# Altium schematic sheet LPEDT_revA1_bikeit_POWER.SchDoc: Bike It Power Management (part 3 of 3)
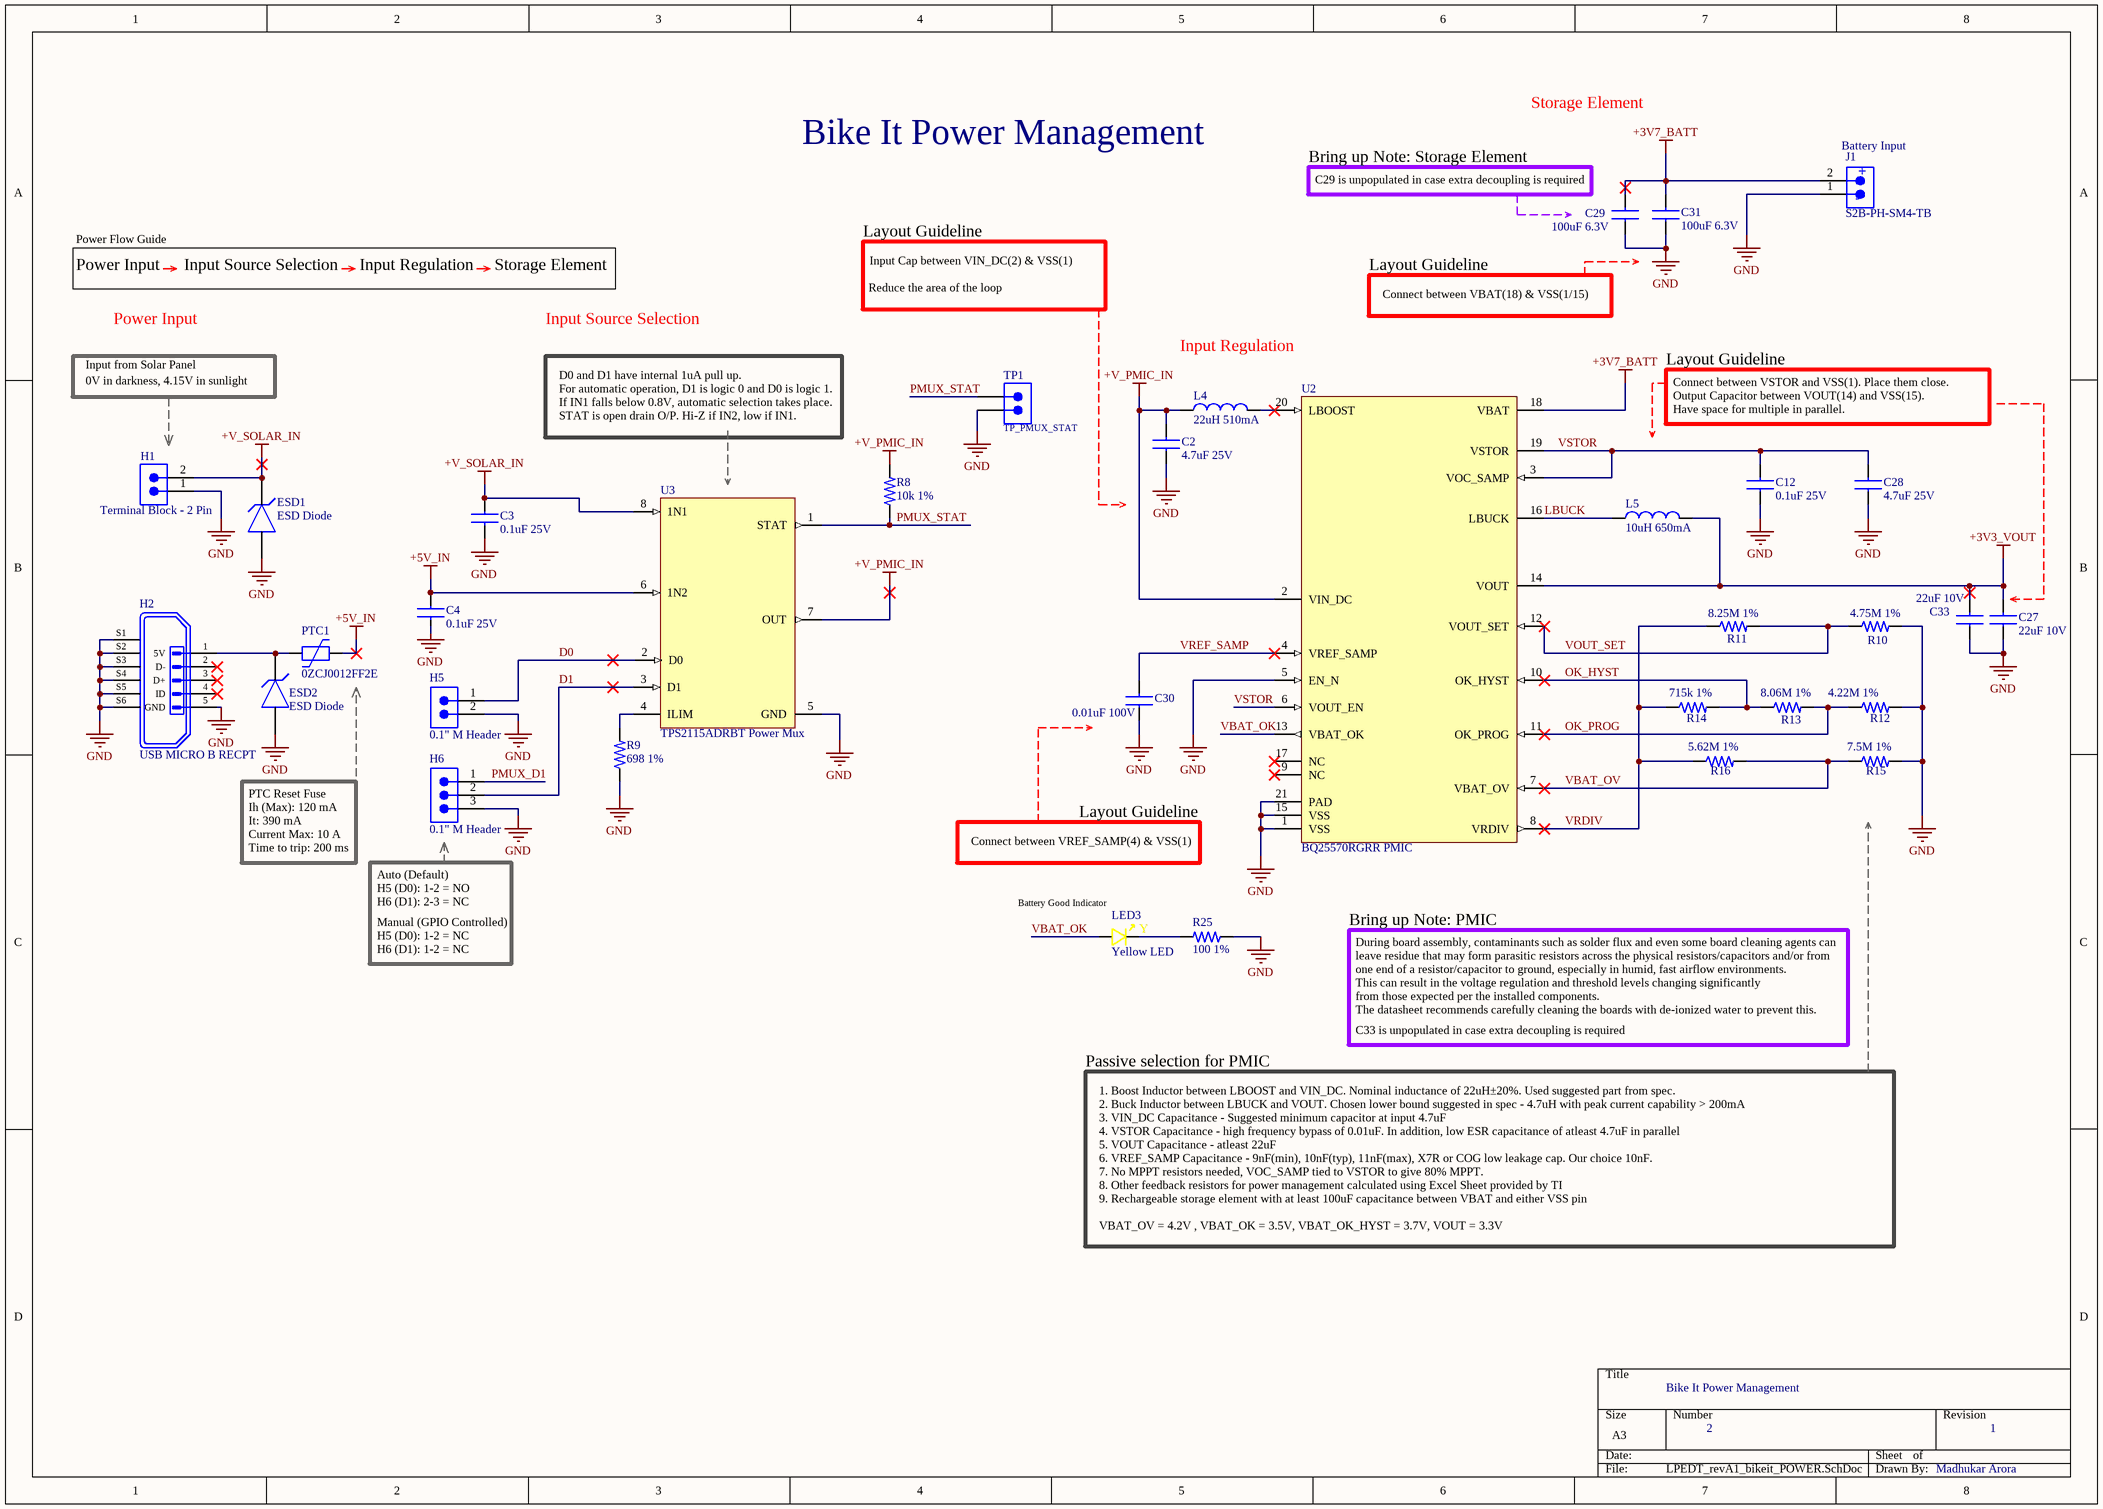
[diagram p2: LPEDT_revA1_bikeit_POWER.SchDoc]

## Library data of the parts (continued)
U2 = BQ25570RGRR: Battery Management Low Pwr Harvester Pwr Mgmt IC; Alternate_PartNumber: BQ25570RGRT; Manufacturer: Texas Instruments; PIN_COUNT: 21; Operating Supply Voltage: 4V; Output Current: 100mA; Operating Supply Current: 488nA; Switching Frequency: 1MHz; Application_BuildNumber: *; PartNumber: BQ25570RGRR; PackageReference: RGR0020A; MountType: SMT; CompType: IC; RoHS: Y; RefDes: RefDes; Type: DEV; Value: Value; Copyright: Copyright (C) 2018 Accelerated Designs. All rights reserved; Supplier 1: Digi-Key; Manufacturer Part Number: BQ25570RGRR; Category: Battery Management; Stock 1: 3521; Pricing 1: 1=7.10000, 10=6.41800, 25=6.11920, 100=5.07440, 250=4.62668, 500=4.32820, 1000=3.94240 (USD); Mount: Surface Mount; Case/Package: VQFN; Number of Pins: 20; Contact Plating: Gold; Min Operating Temperature: -40°C; Max Operating Temperature: 125°C; Packaging: Tape and Reel; Package Quantity: 3000; RoHS Compliant: Yes; Lead Free: Lead Free; ComponentLink1URL: https://datasheet.ciiva.com/29590/bq25570-29590060.pdf?src-supplier=Digi-Key; ComponentLink1Description: https://datasheet.ciiva.com/29590/bq25570-29590060.pdf?src-supplier=Digi-Key; Supplier Part Number 1: 296-39934-1-ND
U3 = TPS2115ADRBT: OR Controller Source Selector Switch N-Channel 2:1 8-SON (3x3); Manufacturer: Texas Instruments; Number of Outputs: 1; Number of Inputs: 2; Max Power Dissipation: 2.5W; Output Current: 1.25A; Nominal Supply Current: 55uA; Max Input Voltage: 5.5V; Min Input Voltage: 2.8V; Turn-On Delay Time: 1ms; Turn-Off Delay Time: 5ms; On-State Resistance: 110mR; Max Supply Current: 90uA; Manufacturer Part Number: TPS2115ADRBT; RoHS: Yes; Category: Power Management ICs; Stock 1: 1983; Pricing 1: 1=2.44000, 10=2.18800, 25=2.06440, 100=1.65150 (USD); Case/Package: SON; Number of Pins: 8; Weight: 0.000847oz; Min Operating Temperature: -40°C; Max Operating Temperature: 85°C; Packaging: Tape and Reel; Package Quantity: 250; Max Output Current: 1.25A; Operating Supply Current: 55uA; Current - Output 2: 1.25A; Operating Supply Voltage: 5.5V; Series: -; Number of Switches: 1; Supply Current: 55uA; Radiation Hardening: No; REACH SVHC: No SVHC; Lead Free: Lead Free; RoHS Compliant: Yes; ComponentLink1URL: https://datasheet.ciiva.com/15109/getdatasheetpartid-445171-15109276.pdf?src-supplier=Verical; ComponentLink1Description: https://datasheet.ciiva.com/15109/getdatasheetpartid-445171-15109276.pdf?src-supplier=Verical; ComponentLink2URL: https://datasheet.ciiva.com/1961/tps2115a-1961013.pdf?src-supplier=Digi-Key; ComponentLink2Description: https://datasheet.ciiva.com/1961/tps2115a-1961013.pdf?src-supplier=Digi-Key; ComponentLink3URL: https://datasheet.ciiva.com/3232/tps2115a-3232473.pdf?src-supplier=Avnet; ComponentLink3Description: https://datasheet.ciiva.com/3232/tps2115a-3232473.pdf?src-supplier=Avnet; ComponentLink4URL: https://datasheet.ciiva.com/25905/sbvs044f-25905737.pdf?src-supplier=Avnet+Europe; ComponentLink4Description: https://datasheet.ciiva.com/25905/sbvs044f-25905737.pdf?src-supplier=Avnet+Europe; ComponentLink5URL: https://datasheet.ciiva.com/3232/tps2115a-3232538.pdf?src-supplier=Avnet; ComponentLink5Description: https://datasheet.ciiva.com/3232/tps2115a-3232538.pdf?src-supplier=Avnet; ComponentLink6URL: https://datasheet.ciiva.com/28652/1862467-28652426.pdf?src-supplier=Element14; ComponentLink6Description: https://datasheet.ciiva.com/28652/1862467-28652426.pdf?src-supplier=Element14; Supplier Part Number 1: 296-39358-1-ND; Supplier 1: Digi-Key